# EAGLE design P1R3 (EAGLE 7.2.0)

## Sheet 1 of 2
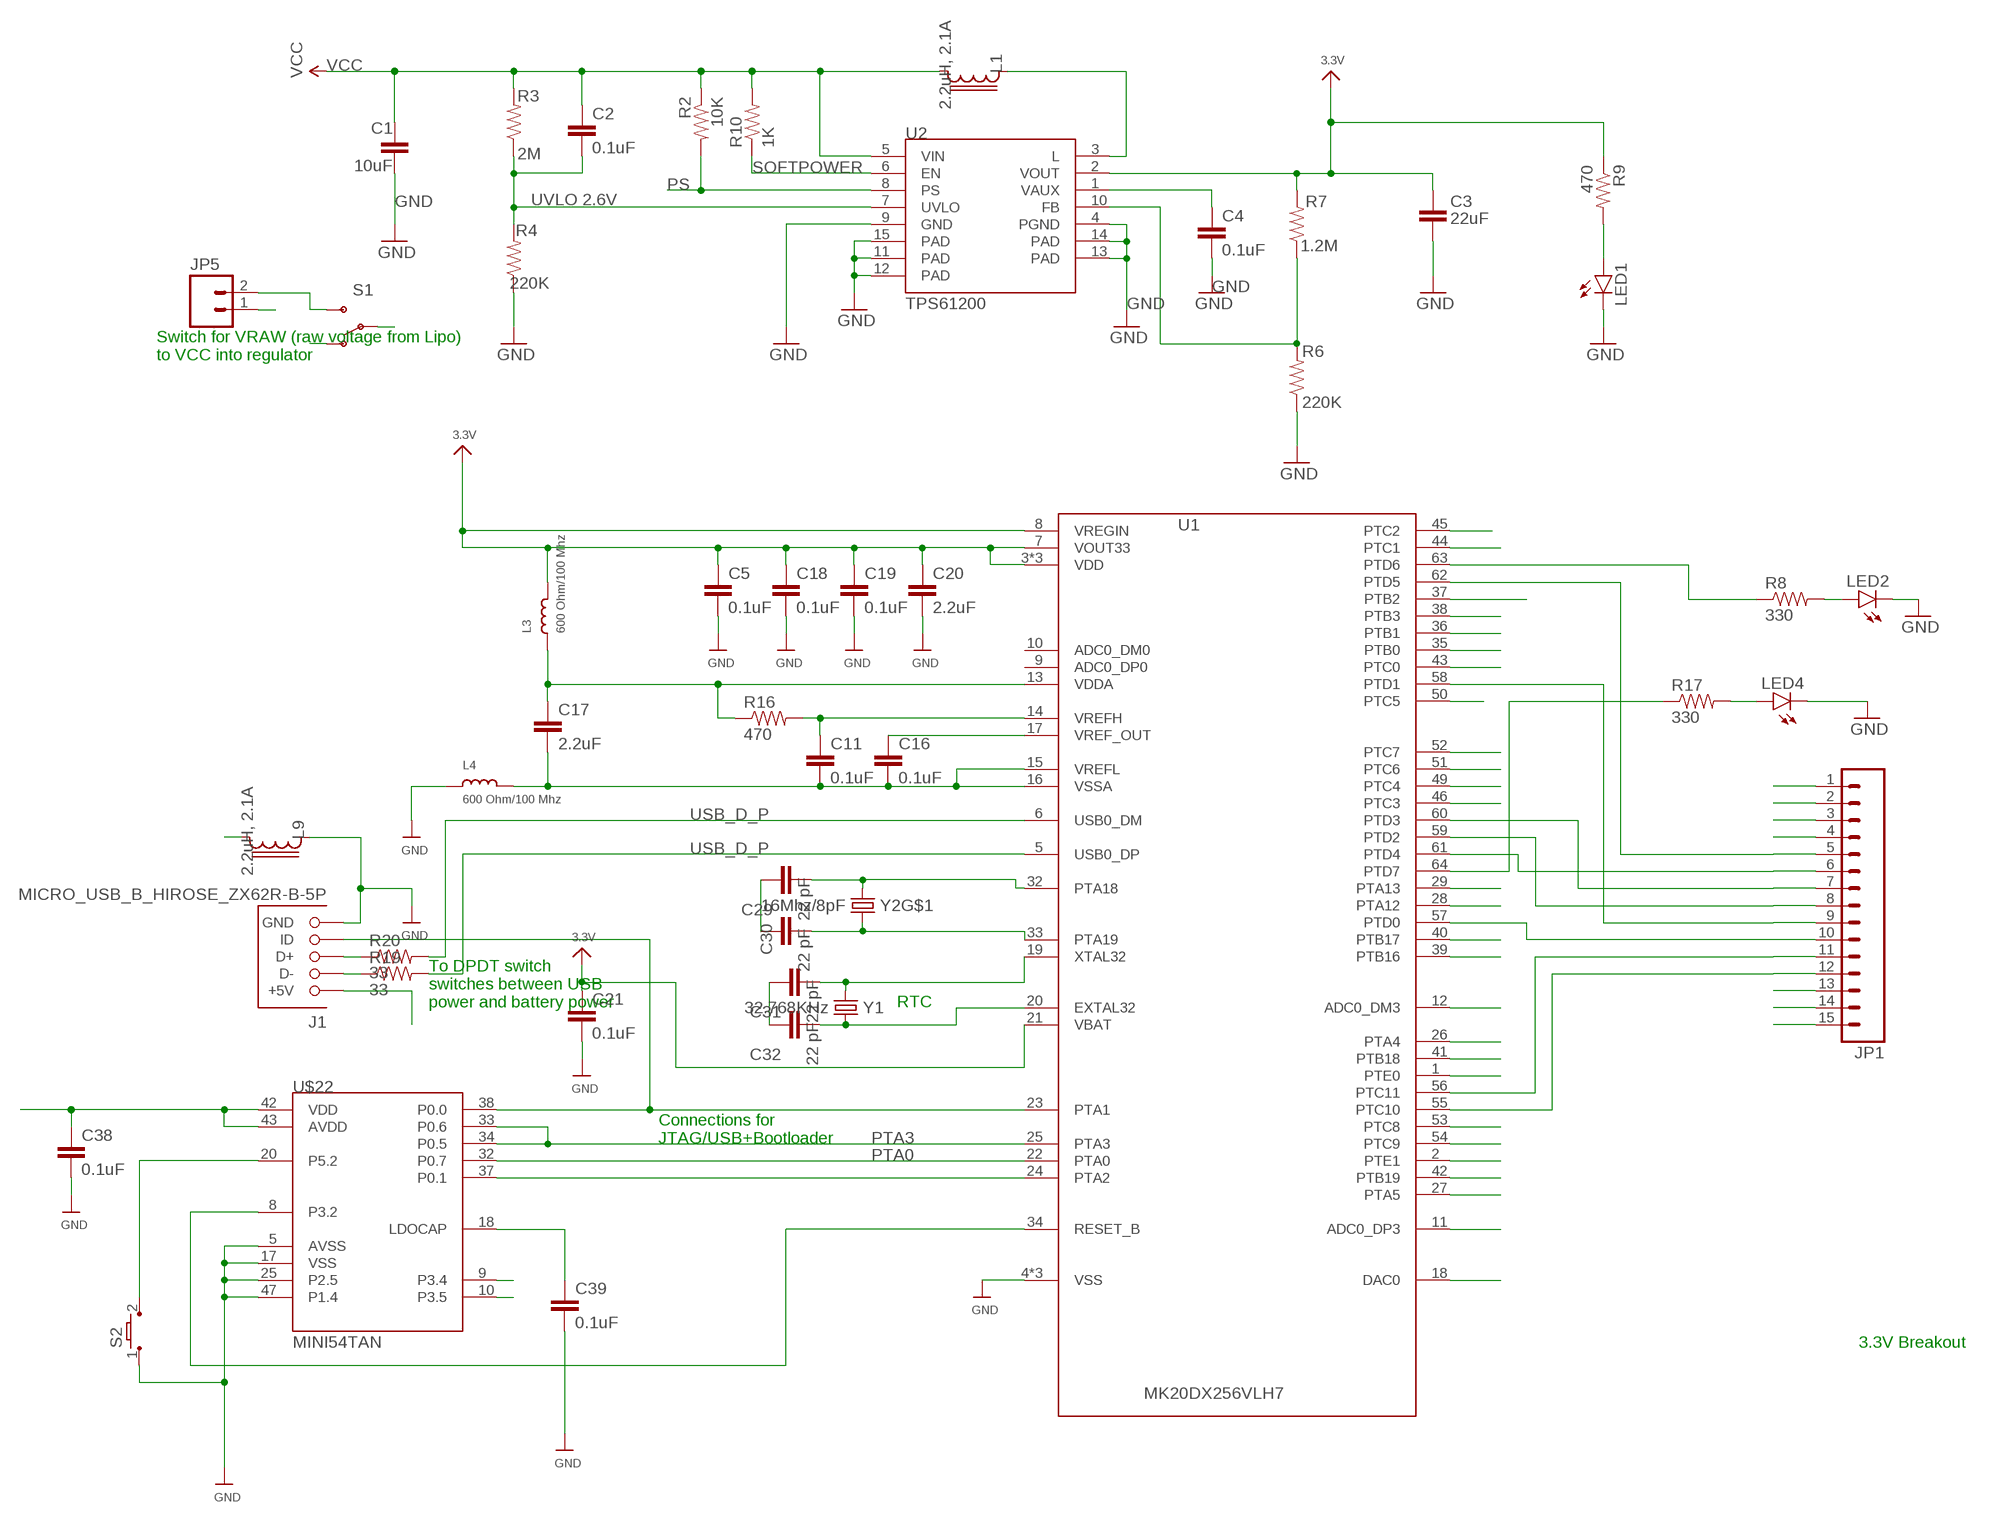
[diagram p0: schematic, sheet 1]

### Parts
C1  10uF  CAPACITOR-10UF  [0603-CAP]
C2  0.1uF  CAPACITOR-0.1UF  [0603-CAP]
C3  22uF  CAPACITOR-22UF  [0603-CAP]
C4  0.1uF  CAPACITOR-0.1UF  [0603-CAP]
C5  0.1uF  CAPACITOR-0.1UF  [0603-CAP]
C11  0.1uF  CAPACITOR-0.1UF  [0603-CAP]
C16  0.1uF  CAPACITOR-0.1UF  [0603-CAP]
C17  2.2uF  CAPACITOR-2.2UF  [0603-CAP]
C18  0.1uF  CAPACITOR-0.1UF  [0603-CAP]
C19  0.1uF  CAPACITOR-0.1UF  [0603-CAP]
C20  2.2uF  CAPACITOR-2.2UF  [0603-CAP]
C21  0.1uF  CAPACITOR-0.1UF  [0603-CAP]
C29  22 pF  CAPACITOR-10UF  [0603-CAP]
C30  22 pF  CAPACITOR-10UF  [0603-CAP]
C31  22 pF  CAPACITOR-10UF  [0603-CAP]
C32  22 pF  CAPACITOR-10UF  [0603-CAP]
C38  0.1uF  CAPACITOR-0.1UF  [0603-CAP]
C39  0.1uF  CAPACITOR-0.1UF  [0603-CAP]
J1  MICRO_USB_B_HIROSE_ZX62R-B-5P  [USB_MICRO_B-HIROSE-ZX62R-B-5P]
JP1  M15  [1X15]
JP5  M02PTH  [1X02]
L1  2.2uH, 2.1A  LPS30152.2UH  [LPS3015]
L3  600 Ohm/100 Mhz  INDUCTOR-BK2125HM601-T  [0805]
L4  600 Ohm/100 Mhz  INDUCTOR-BK2125HM601-T  [0805]
L9  2.2uH, 2.1A  LPS30152.2UH  [LPS3015]
LED1  LED-GREEN  [LED-0603]
LED2  LED-GREEN  [LED-0603]
LED4  LED-GREEN  [LED-0603]
R2  10K  RESISTOR-10K  [0603-RES]
R3  2M  RESISTOR-2M  [0603-RES]
R4  220K  RESISTOR-220K  [0603-RES]
R6  220K  RESISTOR-220K  [0603-RES]
R7  1.2M  RESISTOR-1.2M  [0603-RES]
R8  330  RESISTOR-470  [0603-RES]
R9  470  RESISTOR-470  [0603-RES]
R10  1K  RESISTOR-1K  [0603-RES]
R16  470  RESISTOR-470  [0603-RES]
R17  330  RESISTOR-470  [0603-RES]
R19  33  RESISTOR0402-RES  [0402-RES]
R20  33  RESISTOR0402-RES  [0402-RES]
S1  SWITCH-SPDT-SMD-A  [SWITCH-SPST-SMD-A]
S2  TL3302-G  [TL3302_GULL_WING]
U1  MK20DX256VLH7  [MK20DX256VLH7]
U2  TPS61200  [QFN-10_PAD]
U$22  MINI54TAN  [MINI54TAN]
Y1  32.768KHz  CRYSTAL/32.768KHZ/SMD-TXC_7A  [CRYSTAL-TXC-7A]
Y2  16Mhz/8pF  CRYSTAL/SMD-5X3-GND16MHZ/8PF  [CRYSTAL-SMD-5X3]

### Nets
3.3V: C3.1 C5.1 C18.1 C19.1 C20.1 C21.1 C38.1 JP1.13 JP1.14 JP1.15 L3.2 R7.2 R9.1 U1.3(VDD) U1.7(VOUT33) U1.8(VREGIN) U1.21(VBAT) U1.30(VDD) U1.48(VDD) U2.2(VOUT) U$22.42(VDD) U$22.43(AVDD) ; also sheet 2
A12: U1.11(ADC0_DP3)
A13: U1.12(ADC0_DM3)
AD0: U1.45(PTC2) ; also sheet 2
DAC/A14: U1.18(DAC0)
FB: R6.2 R7.1 U2.10(FB)
GND [Top GND Pour]: C1.2 C3.2 C4.2 C5.2 C18.2 C19.2 C20.2 C21.2 C29.1 C30.1 C31.1 C32.1 C38.2 C39.2 J1.5(GND) JP1.1 JP1.2 JP1.3 JP1.4 JP5.1 L4.1 L9.1 LED1.C LED2.C LED4.C R4.1 R6.1 S2.1 U1.4(VSS) U1.31(VSS) U1.47(VSS) U2.4(PGND) U2.9(GND) U2.11(PAD) U2.12(PAD) U2.13(PAD) U2.14(PAD) U2.15(PAD) U$22.5(AVSS) U$22.17(VSS) U$22.25(P2.5) U$22.47(P1.4) ; also sheet 2
ID: J1.4(ID) U1.23(PTA1) U$22.38(P0.0)
N$1: LED1.A R9.2
N$2: L1.1 U2.3(L)
N$7: LED2.A R8.2
N$8: J1.3(D+) R20.1
N$9: J1.2(D-) R19.1
N$10: C31.2 U1.19(XTAL32) Y1.P$2
N$11: C32.2 U1.20(EXTAL32) Y1.P$1
N$27: C29.2 U1.32(PTA18) Y2.3
N$28: C30.2 U1.33(PTA19) Y2.1
N$29: LED4.A R17.2
N$40: L9.2
N$49: C39.1 U$22.18(LDOCAP)
N$50: U$22.9(P3.4)
N$51: U$22.10(P3.5)
N$75: S2.2 U$22.20(P5.2)
PS: R2.2 U2.8(PS)
PTA0: U1.22(PTA0) U$22.32(P0.7)
PTA2: U1.24(PTA2) U$22.37(P0.1)
PTA3: U1.25(PTA3) U$22.33(P0.6) U$22.34(P0.5)
PTA4: U1.26(PTA4)
PTA5: U1.27(PTA5)
PTA12: U1.28(PTA12)
PTA13: U1.29(PTA13)
PTB0: U1.35(PTB0) ; also sheet 2
PTB1: U1.36(PTB1) ; also sheet 2
PTB16: U1.39(PTB16) ; also sheet 2
PTB17: U1.40(PTB17) ; also sheet 2
PTB18: U1.41(PTB18) ; also sheet 2
PTB19: U1.42(PTB19) ; also sheet 2
PTC0: U1.43(PTC0) ; also sheet 2
PTC1: U1.44(PTC1) ; also sheet 2
PTC3: U1.46(PTC3) ; also sheet 2
PTC4: U1.49(PTC4) ; also sheet 2
PTC5: U1.50(PTC5) ; also sheet 2
PTC6: U1.51(PTC6) ; also sheet 2
PTC7: U1.52(PTC7) ; also sheet 2
PTC8: U1.53(PTC8) ; also sheet 2
PTC9: U1.54(PTC9) ; also sheet 2
PTC10: JP1.12 U1.55(PTC10)
PTC11: JP1.11 U1.56(PTC11)
PTD0: JP1.10 U1.57(PTD0)
PTD1: JP1.9 U1.58(PTD1)
PTD2: JP1.8 U1.59(PTD2)
PTD3: JP1.7 U1.60(PTD3)
PTD4: JP1.6 U1.61(PTD4)
PTD5: JP1.5 U1.62(PTD5)
PTD6: R8.1 U1.63(PTD6)
PTD7: R17.1 U1.64(PTD7)
PTE0: U1.1(PTE0)
PTE1: U1.2(PTE1)
RESET_B: U1.34(RESET_B) U$22.8(P3.2)
SCL: U1.37(PTB2) ; also sheet 2
SDA: U1.38(PTB3) ; also sheet 2
SOFTPOWER: R10.1 U2.6(EN)
USB_D_N [USB]: R19.2 U1.5(USB0_DP)
USB_D_P [USB]: R20.2 U1.6(USB0_DM)
UVLO: C2.2 R3.1 R4.2 U2.7(UVLO)
VAUX: C4.1 U2.1(VAUX)
VBAT: JP5.2 S1.3(S)
VCC: C1.1 C2.1 L1.2 R2.1 R3.2 R10.2 S1.2(P) U2.5(VIN)
VDDA: C17.1 L3.1 R16.1 U1.13(VDDA)
VREF_OUT: C16.1 U1.17(VREF_OUT)
VREFH: C11.1 R16.2 U1.14(VREFH)
VREFL: C11.2 C16.2 C17.2 L4.2 U1.15(VREFL) U1.16(VSSA)
VUSB: J1.1(+5V) S1.1(O)
Unconnected: U1.9(ADC0_DP0) U1.10(ADC0_DM0) Y2.2(GND:GND) Y2.4(GND:GND)

### Notes on the sheet
- UVLO 2.6V
- Switch for VRAW (raw voltage from Lipo) 
  to VCC into regulator
- To DPDT switch
  switches between USB
  power and battery power
- RTC
- Connections for 
  JTAG/USB+Bootloader
- 3.3V Breakout

## Sheet 2 of 2
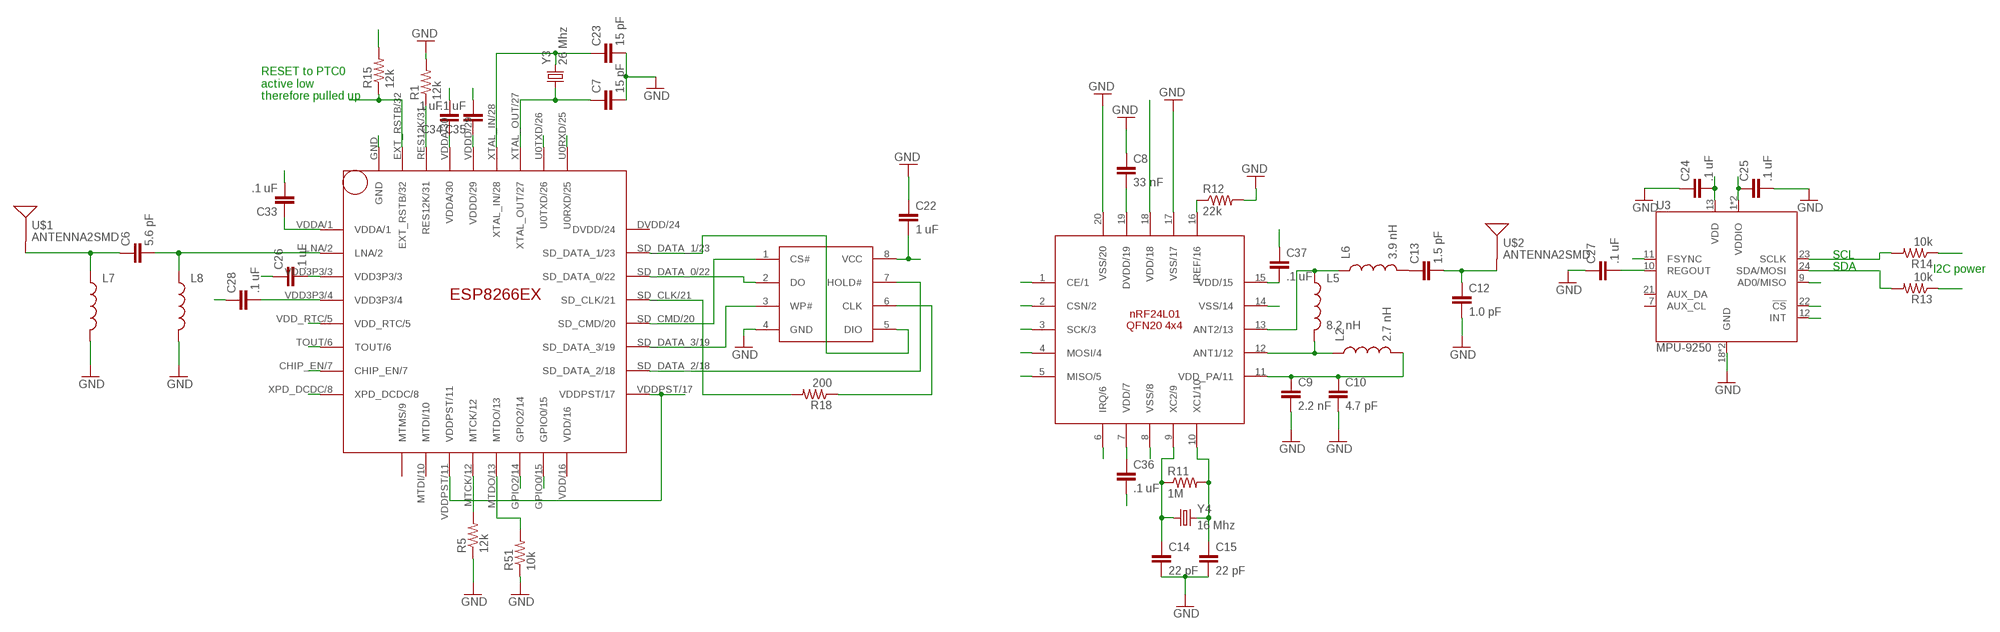
[diagram p1: schematic, sheet 2]

### Parts
C6  5.6 pF  CAP0603-CAP  [0603-CAP]
C7  15 pF  CAP0603-CAP  [0603-CAP]
C8  33 nF  CAP0603-CAP  [0603-CAP]
C9  2.2 nF  CAP0603-CAP  [0603-CAP]
C10  4.7 pF  CAP0603-CAP  [0603-CAP]
C12  1.0 pF  CAP0603-CAP  [0603-CAP]
C13  1.5 pF  CAP0603-CAP  [0603-CAP]
C14  22 pF  CAP0603-CAP  [0603-CAP]
C15  22 pF  CAP0603-CAP  [0603-CAP]
C22  1 uF  CAP0603-CAP  [0603-CAP]
C23  15 pF  CAP0603-CAP  [0603-CAP]
C24  .1 uF  CAP0603-CAP  [0603-CAP]
C25  .1 uF  CAP0603-CAP  [0603-CAP]
C26  .1 uF  CAP0603-CAP  [0603-CAP]
C27  .1 uF  CAP0603-CAP  [0603-CAP]
C28  .1 uF  CAP0603-CAP  [0603-CAP]
C33  .1 uF  CAP0603-CAP  [0603-CAP]
C34  .1 uF  CAP0603-CAP  [0603-CAP]
C35  .1 uF  CAP0603-CAP  [0603-CAP]
C36  .1 uF  CAP0603-CAP  [0603-CAP]
C37  .1 uF  CAP0603-CAP  [0603-CAP]
L2  2.7 nH  INDUCTOR0402  [C0402]
L5  8.2 nH  INDUCTOR0402  [C0402]
L6  3.9 nH  INDUCTOR0402  [C0402]
L7  INDUCTOR30OHM,1.8A  [0603]
L8  INDUCTOR30OHM,1.8A  [0603]
R1  12k  RESISTOR0603-RES  [0603-RES]
R5  12k  RESISTOR0603-RES  [0603-RES]
R11  1M  RESISTOR0603-RES  [0603-RES]
R12  22k  RESISTOR0603-RES  [0603-RES]
R13  10k  RESISTOR0603-RES  [0603-RES]
R14  10k  RESISTOR0603-RES  [0603-RES]
R15  12k  RESISTOR0603-RES  [0603-RES]
R18  200  RESISTOR0603-RES  [0603-RES]
R51  10k  RESISTOR0603-RES  [0603-RES]
U3  MPU-9250  [QFN-24/3MM]
U$1  ANTENNA2SMD  [ANTENNA-CHIP2]
U$2  ANTENNA2SMD  [ANTENNA-CHIP2]
U$3  25Q40  [SOP8]
U$4  NRF24L01  [QFN20(4X4)]
U$6  ESP8266EX  [QFN32]
Y3  26 Mhz  CRYSTAL5X3  [CRYSTAL-SMD-5X3]
Y4  16 Mhz  CRYSTAL5X3  [CRYSTAL-SMD-5X3]

### Nets
3.3V: C22.2 C24.2 C25.1 C26.2 C28.2 C33.1 C34.1 C35.1 C36.1 C37.2 R13.1 R14.1 R15.2 U3.1(VDDIO) U3.8(VDDIO) U3.13(VDD) U3.22(!CS) U$3.8(VCC) U$4.7(VDD/7) U$4.15(VDD/15) U$4.18(VDD/18) U$6.VDD3P3/3 U$6.VDD3P3/4 U$6.VDDA/1 U$6.VDDA/30 U$6.VDDD/29 U$6.VDDPST/11 U$6.VDDPST/17 ; also sheet 1
AD0: U3.9(AD0/MISO) ; also sheet 1
GND [Top GND Pour]: C7.2 C8.1 C9.2 C10.2 C12.2 C14.2 C15.2 C22.1 C23.2 C24.1 C25.2 C26.1 C27.1 C28.1 C33.2 C34.2 C35.2 C36.2 C37.1 L7.2 L8.2 R1.2 R5.1 R12.2 R51.1 U3.18(GND) U3.20(GND) U$3.4(GND) U$4.8(VSS/8) U$4.14(VSS/14) U$4.17(VSS/17) U$4.20(VSS/20) U$6.GND ; also sheet 1
MTDO: R51.2 U$6.MTDO/13
N$13: C6.2 L8.1 U$6.LNA/2
N$16: C6.1 L7.1 U$1.FEED(SIGNAL)
N$17: C14.1 R11.1 U$4.9(XC2/9) Y4.1
N$18: C15.1 R11.2 U$4.10(XC1/10) Y4.3
N$19: C9.1 C10.1 L2.2 U$4.11(VDD_PA/11)
N$20: L5.1 L6.1 U$4.13(ANT2/13)
N$21: C8.2 U$4.19(DVDD/19)
N$23: L2.1 L5.2 U$4.12(ANT1/12)
N$24: R12.1 U$4.16(IREF/16)
N$25: C13.1 L6.2
N$26: C12.1 C13.2 U$2.FEED(SIGNAL)
N$32: R5.2 U$6.MTCK/12
N$34: C27.2 U3.10(REGOUT)
N$35: R18.1 U$3.6(CLK)
N$38: R1.1 U$6.RES12K/31
PTB0: U3.12(INT) ; also sheet 1
PTB1: U3.11(FSYNC) ; also sheet 1
PTB16: U$6.U0TXD/26 ; also sheet 1
PTB17: U$6.U0RXD/25 ; also sheet 1
PTB18: U$6.GPIO0/15 ; also sheet 1
PTB19: U$6.GPIO2/14 ; also sheet 1
PTC0: R15.1 U$6.EXT_RSTB/32 ; also sheet 1
PTC1: U$6.CHIP_EN/7 ; also sheet 1
PTC3: U$6.XPD_DCDC/8 ; also sheet 1
PTC4: U$4.2(CSN/2) ; also sheet 1
PTC5: U$4.3(SCK/3) ; also sheet 1
PTC6: U$4.4(MOSI/4) ; also sheet 1
PTC7: U$4.5(MISO/5) ; also sheet 1
PTC8: U$4.6(IRQ/6) ; also sheet 1
PTC9: U$4.1(CE/1) ; also sheet 1
RTC: U$6.VDD_RTC/5
SCL: R14.2 U3.23(SCLK) ; also sheet 1
SD-CLK: R18.2 U$6.SD_CLK/21
SD-CMD: U$3.1(CS#) U$6.SD_CMD/20
SD-D0: U$3.2(DO) U$6.SD_DATA_0/22
SD-D1: U$3.5(DIO) U$6.SD_DATA_1/23
SD-D2: U$3.7(HOLD#) U$6.SD_DATA_2/18
SD-D3: U$3.3(WP#) U$6.SD_DATA_3/19
SDA: R13.2 U3.24(SDA/MOSI) ; also sheet 1
TOUT: U$6.TOUT/6
XTAL_IN: C23.1 U$6.XTAL_IN/28 Y3.3
XTAL_OUT: C7.1 U$6.XTAL_OUT/27 Y3.1
Unconnected: U3.7(AUX_CL) U3.21(AUX_DA) U$6.DVDD/24 U$6.MTDI/10 U$6.MTMS/9 U$6.VDD/16

### Notes on the sheet
- RESET to PTC0
  active low
  therefore pulled up
- SCL
- I2C power
- SDA

## Library data of the parts
C1 = appfruits:CAPACITOR; MF: Murata; MPN: GRM188R60J106ME47D
C2 C4 C5 C11 C16 C18 C19 C21 C38 C39 = appfruits:CAPACITOR; MF: Kemet; MPN: C0603C104J3RACTU
C3 = appfruits:CAPACITOR; MF: Murata; MPN: GRM188R60J226MEA0D
C6-C10 C12-C15 C22-C28 C33-C37 = SparkFun-Capacitors:CAP: Capacitor Standard 0603 ceramic capacitor, and 0.1" leaded capacitor.
C17 C20 = appfruits:CAPACITOR; MF: Kemet; MPN: C0603C225K4PACTU
C29-C32 = appfruits:CAPACITOR; MF: Murata; MPN: GRM188R60J106ME47D; VALUE: 10uF
J1 = connector:MICRO_USB_B_HIROSE_ZX62R-B-5P: USB Micro B Connector Rounded side is up.; DIGIKEY: H11574CT-ND; MOUSER: 798-ZX62R-B-5P; NEWARK: 69W0714
JP1 = SparkFun-Connectors:M15: Header 15 Standard 15-pin 0.1" header. Use with straight break away headers (SKU : PRT-00116), right angle break away headers (PRT-00553), swiss pins (PRT-00743), machine pins (PRT-00117), and female headers (PRT-00115).
JP5 = SparkFun-Connectors:M02: Standard 2-pin 0.1" header. Use with - straight break away headers ( PRT-00116) - right angle break away headers (PRT-00553) - swiss pins (PRT-00743) - machine pins (PRT-00117) - female headers (PRT-00115) Molex polarized connector foot print use with: PRT-08233 with associated crimp pins and housings. 2.54_SCREWTERM for use with PRT-10571. 3.5mm Screw Terminal footprints for PRT-08084 5mm Screw Terminal footprints for use with PRT-08432
L1 L9 = appfruits:LPS3015: Shielded Power Inductor; MF: Coilcraft; MPN: LPS3015-222MRB
L2 L5 L6 = SparkFun-Passives:INDUCTOR: Inductors
L3 L4 = appfruits:INDUCTOR: Inductors; MF: Taiyo Yuden; MPN: BK2125HM601-T
L7 L8 = SparkFun-Passives:INDUCTOR: Inductors; PROD_ID: RES-07859
LED1 LED2 LED4 = appfruits:LED: LEDs Standard schematic elements and footprints for 5mm, 3mm, 1206, and 0603 sized LEDs. 5mm - Spark Fun Electronics SKU : COM-00529 (and others); MF: Avago; MPN: HSMG-C190
R1 R5 R11-R15 R18 R51 = SparkFun-Resistors:RESISTOR: Resistor
R2 = appfruits:RESISTOR: Resistor; MF: Panasonic; MPN: ERJ-3GEYJ103V
R3 = appfruits:RESISTOR: Resistor; MF: Panasonic; MPN: ERJ-3GEYJ205V
R4 R6 = appfruits:RESISTOR: Resistor; MF: Panasonic; MPN: ERJ-3GEYJ224V
R7 = appfruits:RESISTOR: Resistor; MF: Panasonic; MPN: ERJ-3GEYJ125V
R8 R17 = appfruits:RESISTOR: Resistor; MF: Panasonic; MPN: ERJ-3GEYJ471V; VALUE: 470
R9 R16 = appfruits:RESISTOR: Resistor; MF: Panasonic; MPN: ERJ-3GEYJ471V
R10 = appfruits:RESISTOR: Resistor; MF: Panasonic; MPN: ERJ-3GEYJ102V
R19 R20 = SparkFun:RESISTOR: Resistor
S1 = SparkFun-Electromechanical:SWITCH-SPDT: SPDT Switch Simple slide switch, Spark Fun Electronics SKU : COM-00102 DPDT SMT slide switch, AYZ0202, SWCH-08179
S2 = eswitch-tact:TL3302: E-Switch TL3302 Series Tactile Switch Surface mount button commonly used for reset or general input. 3.5 x 6mm packaged design. -G: Gull wing termination. Parts TL-3302-x-xxxx-x-G -J: J-Lead termination. Parts TL-3302-x-xxxx-x-J Source: http://www.e-switch.com/Portals/0/Series_Pdf/TL3302.pdf Supplier: DigiKey: http://be.digikey.com/scripts/dksearch/dksus.dll?vendor=0&keywords=TL3302
U1 = appfruits:MK20DX256VLH7; MF: Freescale; MPN: MK20DX256VLH7
U2 = appfruits:TPS61200: DC to DC Booster IC-10035; MF: Texas Instruments; MPN: TPS61200DRCR; PROD_ID: IC-10035
U3 = chips:MPU-9250: GYRO/ACCEL/COMPASS/9-AXIS; DIGIKEY: 1428-1019-1-ND
U$1 U$2 = SparkFun-RF:ANTENNA2: Chip antenna Single endded antenna. Common with smaller chip antennas. CHIP4 package is the GPS Chip Antenna SKU: GPS-08418. CHIP5 package is 2.4GHz chip antenna SKU: WRL-00144.
U$3 = wifi:25Q40
U$4 = RF:NRF24L01
U$6 = wifi:ESP8266EX
U$22 = TeensyCustom:MINI54TAN: MINI54TAN Bootloader from PJRC.com, preprogrammed with Teensy 3.0 bootloader. https://www.pjrc.com/store/ic_mini54_tqfp.html
Y1 = appfruits:CRYSTAL/32.768KHZ/SMD-TXC_7A; MF: Epson Timing; MPN: FC-255 32.7680K-A3
Y2 = appfruits:CRYSTAL/SMD-5X3-GND; MF: ECS; MPN: ECS-160-8-30B-CKM
Y3 Y4 = SparkFun-FreqCtrl:CRYSTAL: Various standard crystals. Proven footprints.; PROD_ID: XTAL-08218

## Net classes
1 USB: width 0.254 mm, drill 0.33 mm, clearance 0.159 mm
2 Top GND Pour: clearance 0.127 mm to class 0, clearance 1.27 mm to class 1

## Board
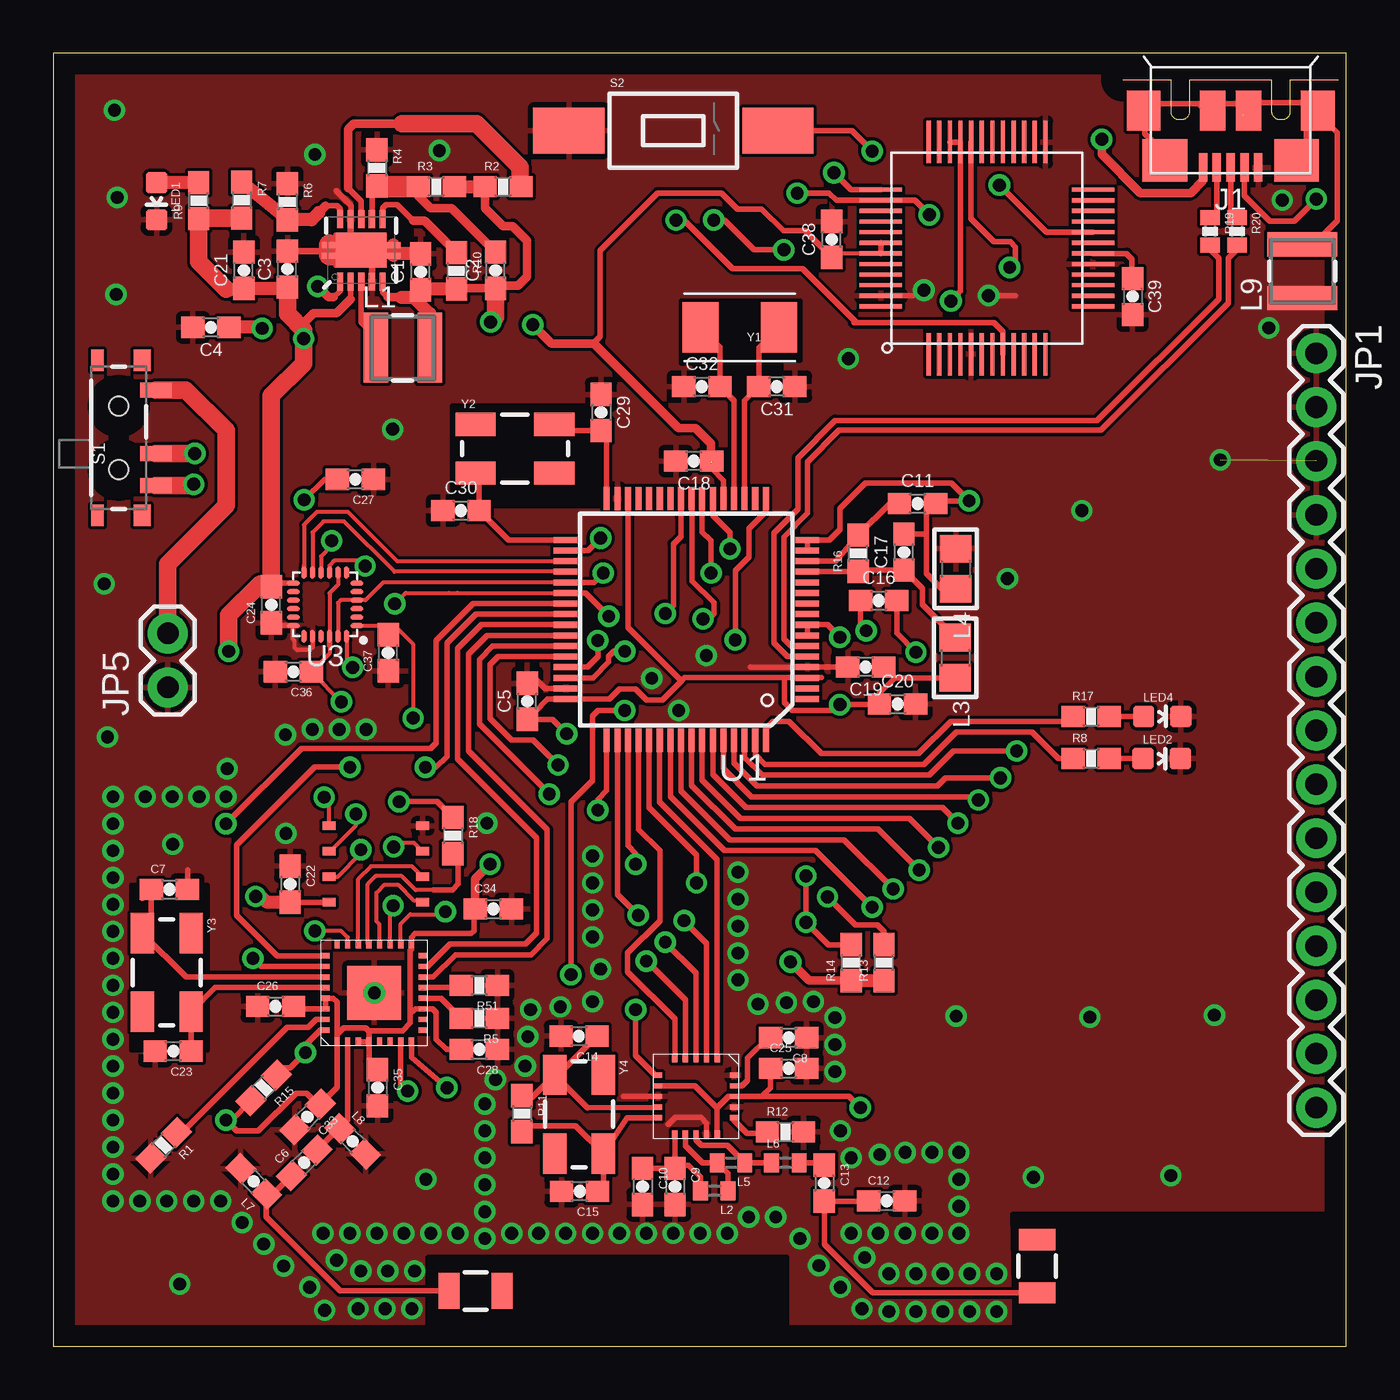
[diagram p2: board, top side]
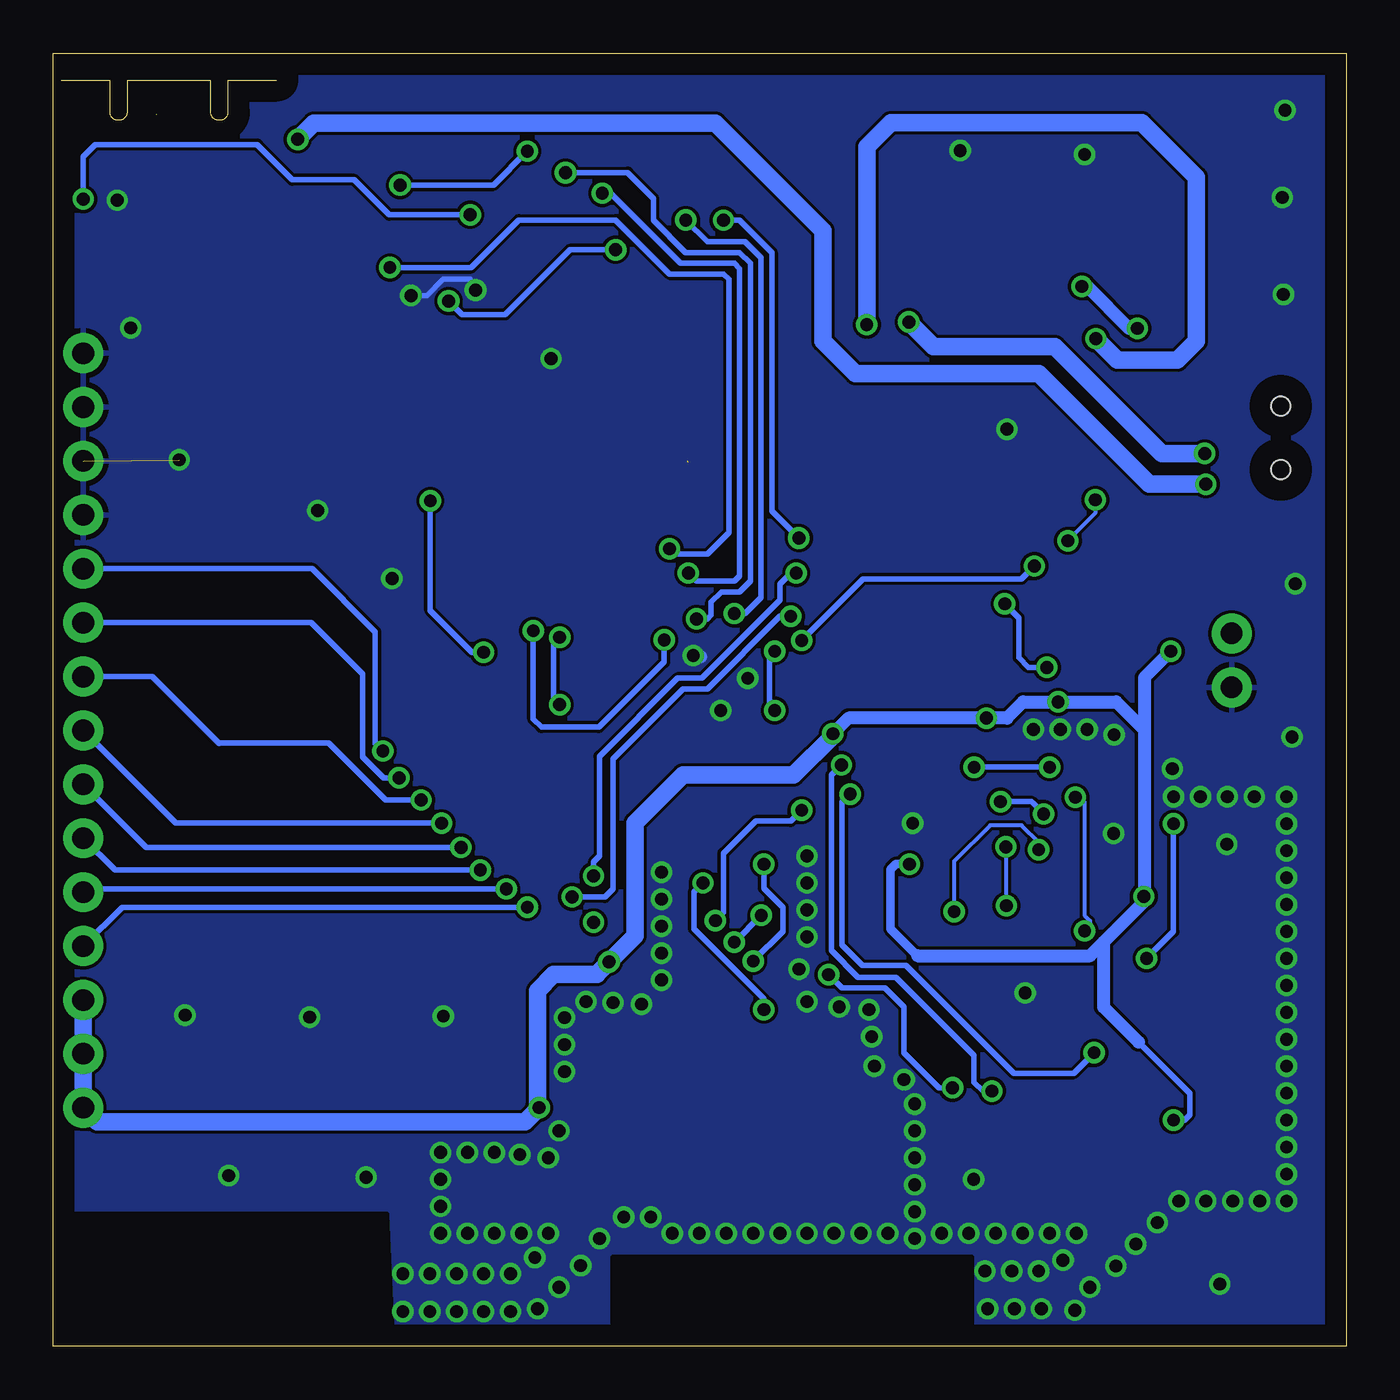
[diagram p3: board, bottom side, seen from below]

Size 60.96 x 60.96 mm. Coordinates in mm from the lower left corner, seen from the top.
Outline: 0,0 60.96,0 60.96,60.96 0,60.96 0,0
Copper layers (1*16): Top 0.035mm / dielectric 1.5mm / Bottom 0.035mm
Design rules "default *": minimum track width 10mil, minimum drill 23mil, track to track 6mil, track to pad 6mil, pad to pad 6mil, via to via 6mil, smd to smd 8mil, copper to edge 40mil, drill to drill 8mil, minimum pad ring 10mil, minimum via ring 8mil, stop-mask expansion 4mil, vias tented up to drill 0mil, thermal gap 10mil
tRestrict: area 3.7,14 to 7.3,21.7; area 18.8,39.6 to 25.8,44.3; area 29.6,44.8 to 35.2,49.3; area 45.2,0.5 to 60.6,6.2; area 17.7,0.3 to 34.6,4.2; area 11.9,50.6 to 16.9,52.8; area 53.5,56.2 to 57.5,57.4
bRestrict: area 45,0.5 to 60.6,6.2; area 17.7,0.3 to 34.6,4.2

### Footprints (pad centres in the part's own frame; a part is rotated, then mirrored left to right if it is on the bottom)
0603-CAP = smd 1.1 x 1: 1 -0.85,0; 2 0.85,0
USB_MICRO_B-HIROSE-ZX62R-B-5P = smd 0.4 x 1.35: 1 1.3,4.125; 2 0.65,4.125; 3 0,4.125; 4 -0.65,4.125; 5 -1.3,4.125 | smd 2.1 x 2: P$1 3.1,3.8; P$2 -3.1,3.8 | smd 1.6 x 1.9: P$3 -4.1,1.45; P$6 4.1,1.45 | smd 1.2 x 1.9: P$4 -0.85,1.45; P$5 0.85,1.45
1X15 = drill 1.016 pad 1.88: 1 0,0; 2 2.54,0; 3 5.08,0; 4 7.62,0; 5 10.16,0; 6 12.7,0; 7 15.24,0; 8 17.78,0; 9 20.32,0; 10 22.86,0; 11 25.4,0; 12 27.94,0; 13 30.48,0; 14 33.02,0; 15 35.56,0
1X02 = drill 1.016 pad 1.88: 1 0,0; 2 2.54,0
LPS3015 = smd 1.14 x 3.3: 1 -1.27,0; 2 1.27,0
C0402 = smd 0.7 x 0.9: 1 -0.65,0; 2 0.65,0
0805 = smd 1.3 x 1.5: 1 -0.95,0; 2 0.95,0
0603 = smd 1.1 x 1: 1 -0.85,0; 2 0.85,0
LED-0603 = smd 1 x 1: A 0,-0.877; C 0,0.877
0603-RES = smd 1.1 x 1: 1 -0.85,0; 2 0.85,0
0402-RES = smd 0.7 x 0.9: 1 -0.65,0; 2 0.65,0
SWITCH-SPST-SMD-A = smd 0.7 x 1.5: 1 -2.25,-1.75; 2 -0.75,-1.75; 3 2.25,-1.75 | smd 1 x 0.6: GND1 -3.65,1; GND3 3.65,1 | smd 1 x 0.8: GND2 -3.65,-1.1; GND4 3.65,-1.1 | hole 0.9: -1.5,0; 1.5,0
TL3302_GULL_WING = smd 3.35 x 2.16: 1 -4.925,0; 2 4.925,0
MK20DX256VLH7 = smd 1.1 x 0.285: 1 -5.7,3.75; 2 -5.7,3.25; 3 -5.7,2.75; 4 -5.7,2.25; 5 -5.7,1.75; 6 -5.7,1.25; 7 -5.7,0.75; 8 -5.7,0.25; 9 -5.7,-0.25; 10 -5.7,-0.75; 11 -5.7,-1.25; 12 -5.7,-1.75; 13 -5.7,-2.25; 14 -5.7,-2.75; 15 -5.7,-3.25; 16 -5.7,-3.75; 33 5.7,-3.75; 34 5.7,-3.25; 35 5.7,-2.75; 36 5.7,-2.25; 37 5.7,-1.75; 38 5.7,-1.25; 39 5.7,-0.75; 40 5.7,-0.25; 41 5.7,0.25; 42 5.7,0.75; 43 5.7,1.25; 44 5.7,1.75; 45 5.7,2.25; 46 5.7,2.75; 47 5.7,3.25; 48 5.7,3.75 | smd 0.285 x 1.1: 17 -3.75,-5.7; 18 -3.25,-5.7; 19 -2.75,-5.7; 20 -2.25,-5.7; 21 -1.75,-5.7; 22 -1.25,-5.7; 23 -0.75,-5.7; 24 -0.25,-5.7; 25 0.25,-5.7; 26 0.75,-5.7; 27 1.25,-5.7; 28 1.75,-5.7; 29 2.25,-5.7; 30 2.75,-5.7; 31 3.25,-5.7; 32 3.75,-5.7; 49 3.75,5.7; 50 3.25,5.7; 51 2.75,5.7; 52 2.25,5.7; 53 1.75,5.7; 54 1.25,5.7; 55 0.75,5.7; 56 0.25,5.7; 57 -0.25,5.7; 58 -0.75,5.7; 59 -1.25,5.7; 60 -1.75,5.7; 61 -2.25,5.7; 62 -2.75,5.7; 63 -3.25,5.7; 64 -3.75,5.7
QFN-10_PAD = smd 0.297 x 0.85: 1 -1,-1.475; 2 -0.5,-1.475; 3 0,-1.475; 4 0.5,-1.475; 5 1,-1.475; 6 1,1.475; 7 0.5,1.475; 8 0,1.475; 9 -0.5,1.475; 10 -1,1.475 | smd 0.7 x 0.28: 11 -1.5,0.25; 12 -1.5,-0.25; 13 1.5,0.25; 14 1.5,-0.25 | smd 2.4 x 1.65: 15 0,0
QFN-24/3MM = smd 0.6 x 0.23: 1 -1.5,1; 2 -1.5,0.6; 3 -1.5,0.2; 4 -1.5,-0.2; 5 -1.5,-0.6; 6 -1.5,-1; 13 1.5,-1; 14 1.5,-0.6; 15 1.5,-0.2; 16 1.5,0.2; 17 1.5,0.6; 18 1.5,1 | smd 0.23 x 0.6: 7 -1,-1.5; 8 -0.6,-1.5; 9 -0.2,-1.5; 10 0.2,-1.5; 11 0.6,-1.5; 12 1,-1.5; 19 1,1.5; 20 0.6,1.5; 21 0.2,1.5; 22 -0.2,1.5; 23 -0.6,1.5; 24 -1,1.5
ANTENNA-CHIP2 = smd 1.7 x 1: FEED 0,1.25; P$2 0,-1.25
SOP8 = smd 0.6 x 0.4: 1 -2.2,1.8; 2 -2.2,0.6; 3 -2.2,-0.6; 4 -2.2,-1.8; 5 2.2,-1.8; 6 2.2,-0.6; 7 2.2,0.6; 8 2.2,1.8
QFN20(4X4) = smd 0.4 x 0.25: 1 -1.8,1; 2 -1.8,0.5; 3 -1.8,0; 4 -1.8,-0.5; 5 -1.8,-1; 11 1.8,-1; 12 1.8,-0.5; 13 1.8,0; 14 1.8,0.5; 15 1.8,1 | smd 0.25 x 0.4: 6 -1,-1.8; 7 -0.5,-1.8; 8 0,-1.8; 9 0.5,-1.8; 10 1,-1.8; 16 1,1.8; 17 0.5,1.8; 18 0,1.8; 19 -0.5,1.8; 20 -1,1.8
QFN32 = smd 0.4 x 0.25: CHIP_EN/7 -2.3,-1.25; DVDD/24 2.3,1.75; LNA/2 -2.3,1.25; SD_CLK/21 2.3,0.25; SD_CMD/20 2.3,-0.25; SD_DATA_0/22 2.3,0.75; SD_DATA_1/23 2.3,1.25; SD_DATA_2/18 2.3,-1.25; SD_DATA_3/19 2.3,-0.75; TOUT/6 -2.3,-0.75; VDD3P3/3 -2.3,0.75; VDD3P3/4 -2.3,0.25; VDD_RTC/5 -2.3,-0.25; VDDA/1 -2.3,1.75; VDDPST/17 2.3,-1.75; XPD_DCDC/8 -2.3,-1.75 | smd 0.25 x 0.4: EXT_RSTB/32 -1.75,2.3; GPIO0/15 1.25,-2.3; GPIO2/14 0.75,-2.3; MTCK/12 -0.25,-2.3; MTDI/10 -1.25,-2.3; MTDO/13 0.25,-2.3; MTMS/9 -1.75,-2.3; RES12K/31 -1.25,2.3; U0RXD/25 1.75,2.3; U0TXD/26 1.25,2.3; VDD/16 1.75,-2.3; VDDA/30 -0.75,2.3; VDDD/29 -0.25,2.3; VDDPST/11 -0.75,-2.3; XTAL_IN/28 0.25,2.3; XTAL_OUT/27 0.75,2.3 | smd 2.54 x 2.54: GND 0,0
MINI54TAN = smd 0.2 x 2: 1 -2.75,-5; 2 -2.25,-5; 3 -1.75,-5; 4 -1.25,-5; 5 -0.75,-5; 6 -0.25,-5; 7 0.25,-5; 8 0.75,-5; 9 1.25,-5; 10 1.75,-5; 11 2.25,-5; 12 2.75,-5; 25 2.75,5; 26 2.25,5; 27 1.75,5; 28 1.25,5; 29 0.75,5; 30 0.25,5; 31 -0.25,5; 32 -0.75,5; 33 -1.25,5; 34 -1.75,5; 35 -2.25,5; 36 -2.75,5 | smd 2 x 0.2: 13 5,-2.75; 14 5,-2.25; 15 5,-1.75; 16 5,-1.25; 17 5,-0.75; 18 5,-0.25; 19 5,0.25; 20 5,0.75; 21 5,1.25; 22 5,1.75; 23 5,2.25; 24 5,2.75; 37 -5,2.75; 38 -5,2.25; 39 -5,1.75; 40 -5,1.25; 41 -5,0.75; 42 -5,0.25; 43 -5,-0.25; 44 -5,-0.75; 45 -5,-1.25; 46 -5,-1.75; 47 -5,-2.25; 48 -5,-2.75
CRYSTAL-TXC-7A = smd 1.7 x 2.4: P$1 1.85,0; P$2 -1.85,0
CRYSTAL-SMD-5X3 = smd 1.9 x 1.1: 1 -1.85,-1.15; 2 1.85,-1.15; 3 1.85,1.15; 4 -1.85,1.15

### Placement (x,y rotation side)
C1  17.32,50.65 90 top
C2  20.85,50.72 90 top
C3  11.05,50.77 90 top
C4  7.44,48.03 180 top
C5  22.35,30.4 90 top
C6  11.84,8.66 45 top
C7  5.49,21.54 0 top
C8  34.67,14.55 180 top
C9  29.31,7.54 270 top
C10  27.79,7.54 270 top
C11  40.74,39.73 0 top
C12  39.29,6.86 0 top
C13  36.35,7.7 270 top
C14  24.79,14.63 180 top
C15  24.82,7.32 180 top
C16  38.91,35.15 0 top
C17  40.11,37.44 90 top
C18  30.2,41.73 180 top
C19  38.3,32.03 180 top
C20  39.8,30.28 0 top
C21  8.99,50.72 90 top
C22  11.18,21.79 270 top
C23  5.66,13.92 180 top
C24  10.29,34.95 90 top
C25  34.67,13.11 0 top
C26  10.49,16.03 0 top
C27  14.25,40.87 180 top
C28  20.09,14 180 top
C29  25.83,44.02 270 top
C30  19.23,39.4 0 top
C31  34.11,45.24 180 top
C32  30.58,45.24 0 top
C33  11.99,10.82 225 top
C34  20.75,20.62 0 top
C35  15.29,12.19 270 top
C36  11.33,31.8 180 top
C37  15.8,32.69 90 top
C38  36.7,52.17 90 top
C39  50.88,49.48 270 top
J1  55.5,59.69 180 top
JP1  59.54,46.81 270 top
JP5  5.41,31.06 90 top
L1  16.48,47.07 0 top
L2  31.17,7.34 180 top
L3  42.52,32.46 270 top
L4  42.55,36.65 270 top
L5  31.95,8.66 180 top
L6  34.52,8.66 0 top
L7  9.45,7.77 135 top
L8  14.12,9.68 315 top
L9  58.88,50.67 90 top
LED1  4.88,53.98 180 top
LED2  52.25,27.71 270 top
LED4  52.27,29.69 270 top
R1  5.21,9.47 225 top
R2  21.21,54.66 0 top
R3  18.06,54.66 0 top
R4  15.27,55.55 270 top
R5  20.09,15.47 180 top
R6  11.05,53.95 270 top
R7  8.89,54.03 270 top
R8  48.92,27.71 0 top
R9  6.86,54 90 top
R10  19.02,50.7 270 top
R11  22.1,10.97 270 top
R12  34.52,10.11 0 top
R13  39.17,18.08 90 top
R14  37.62,18.08 90 top
R15  9.93,12.19 225 top
R16  37.95,37.39 90 top
R17  48.92,29.69 0 top
R18  18.85,24.08 270 top
R19  54.53,52.55 270 top
R20  55.8,52.55 270 top
R51  20.09,17.02 180 top
S1  3.1,42.82 90 top
S2  29.24,57.3 0 top
U1  29.84,34.26 180 top
U2  14.53,51.66 0 top
U3  12.83,34.98 180 top
U$1  19.91,2.62 90 top
U$2  46.38,3.78 180 top
U$3  15.21,22.73 180 top
U$4  30.3,11.79 270 top
U$6  15.14,16.66 90 top
U$22  44.02,51.77 0 top
Y1  32.36,48.03 180 top
Y2  21.77,42.32 0 top
Y3  5.36,17.63 270 top
Y4  24.79,10.95 270 top

### Tracks (layer width: path | path; a pad name or v marks a point on that pad's centre or on a via)
3.3V  (via drill 0.6)  (1 unrouted)
  Top 0.178: U3.8 13.44,36.47 13.44,35.92 13.03,35.51 U3.22 | 16.1,33.98 16.97,33.11 v16.97,29.62 | U$22.43 36.9,51.52 C38.1 | 13.03,33.03 13.03,32.65 C36.1 v13.59,30.38 | U3.1 15.36,33.98 C37.2
  Top 0.254: 31.58,39.98 U1.21 31.59,40.82 31.05,41.37 C18.1 | U1.3 35.55,31.52 | 35.55,31.52 36.22,31.52 | L3.2 39.67,31.51 | 39.67,31.51 C19.1 | U1.7 U1.8 36.5,34.02 v37.08,33.43 | 35.55,31.52 34.44,31.52 | 34.44,31.52 29.77,31.52 29.62,31.37 | C24.2 10.46,35.98 U3.13 | U2.2 14.03,49.36 | U$6.VDDA/1 13.39,16.23 13.2,16.41 U$6.VDDD/29 U$6.VDDA/30 11.46,15.91 C26.2 | U$6.VDDA/1 13.39,14.71 13.69,15.01 14.73,15.01 14.89,14.86 | 14.89,14.86 U$6.VDD3P3/4 | U$6.VDD3P3/3 U$6.VDD3P3/4 | 14.89,14.86 14.92,14.88 16.48,14.88 16.84,15.24 16.84,15.67 | 16.84,15.67 17.08,15.91 U$6.VDDPST/11 17.89,15.91 18.06,15.75 18.06,14.48 18.54,13.99 C28.2 | 16.84,15.67 16.84,18.67 16.89,18.72 U$6.VDDPST/17 16.89,19.28 17.07,19.46 19.71,19.46 19.84,19.58 19.84,20.83 | U$4.15 31.3,11.24 | 31.3,11.24 30.26,12.29 U$4.7 | U$6.VDD3P3/4 14.89,13.44 C35.1 | U$6.VDDA/1 13.39,12.22 C33.1 12.48,11.42 11.96,11.94 11.46,11.94 9.68,10.16 8.66,10.16 v8.15,10.67 8.41,10.67 R15.2 | U1.30 27.09,33.89 29.62,31.37 | U$3.8 C22.2 | 31.3,11.24 31.84,11.79 U$4.18 33.4,11.79 | 33.4,11.79 33.81,12.19 33.81,13.09 C25.1 | v38.05,11.25 37.52,11.79 33.4,11.79 | v24.21,28.88 23.53,29.55 C5.1 22.7,29.88 23.32,30.5 U1.48 26.22,30.52 26.7,30.99 27.46,30.99 27.96,30.48 28.73,30.48 29.62,31.37 | 39.67,31.51 38.95,30.79 C20.1 38.93,30.25 v37.08,30.25 36.8,29.97 34.85,29.97 34.47,30.35 34.47,31.5 34.44,31.52 | U$22.43 U$22.42 | 25.45,47.27 25.78,47.6 25.78,51.64 28.5,54.36 31.5,54.36 32.26,53.59 33.4,53.59 34.42,52.58 35.45,52.58 C38.1 | 13.03,33.03 U3.22 | 16.1,33.98 C37.2
  Top 0.406: C22.2 | 14.03,49.36 13.36,48.69 12.28,48.69 11.81,48.22 v11.81,47.5 | C34.1 19.9,22.04 v20.6,22.73 | 31.01,41.66 31.01,42.55 30.28,43.28 29.49,43.28 25.5,47.27 25.45,47.27 23.5,47.27 v22.61,48.16 | 37.64,17.26 35.62,17.26 v34.77,18.11
  Top 0.61: R7.2 8.57,53.18 | 8.15,49.84 8.95,49.84 C21.1 11,49.87 C3.1 | C22.2 10.08,20.93 9.8,21.21 v9.55,21.21 | R14.1 37.64,17.26 39.14,17.26 R13.1
  Top 0.813: 8.15,49.84 6.86,51.13 R9.1 6.88,53.18 R7.2 | C3.1 11.05,48.67 11.81,47.9 v11.81,47.5 11.81,46.33 10.29,44.81 C24.2 10.15,35.94 9.75,35.94 8.28,34.47 v8.28,32.77
  Bottom 0.254: v8.15,10.67 7.64,10.67 7.39,10.92 7.39,11.94 9.8,14.35 | v37.08,33.43 37.36,33.15 37.36,30.53 v37.08,30.25
  Bottom 0.406: v20.6,22.73 21.23,22.73 21.49,22.48 21.49,19.68 20.22,18.41
  Bottom 0.61: v34.75,18.14 v34.77,18.11 | 11.46,19.05 11.46,16 9.8,14.35 | 20.22,18.41 12.09,18.41 11.46,19.05 | 11.46,19.05 9.55,20.95 v9.55,21.21 9.53,21.23 9.53,29.06 | v24.21,28.88 23.47,29.62 v16.97,29.62 16,29.62 15.24,30.38 v13.59,30.38 10.85,30.38 9.53,29.06 | v8.28,32.77 9.53,31.52 9.53,29.06
  Bottom 0.813: JP1.13 JP1.14 | JP1.14 59.28,13.54 | JP1.14 JP1.15 58.88,10.59 38.71,10.59 v38.05,11.25 38.12,11.33 38.12,16.76 37.36,17.53 35.33,17.53 35.33,17.55 v34.75,18.14 33.53,19.36 33.53,24.66 31.27,26.92 26.06,26.92 24.16,28.83 v24.21,28.88 | 59.54,11.63 JP1.14 | v11.81,47.5 10.79,46.48 7.98,46.48 7.09,47.37 7.09,55.12 9.65,57.68 21.46,57.68 22.61,56.54 v22.61,48.16
AD0  (via drill 0.6)
  Top 0.178: v14.71,36.78 14.45,37.03 13.26,37.03 13.03,36.8 U3.9
  Top 0.254: U1.45 25.18,32.02 25.68,32.51 v25.68,33.27
  Bottom 0.254: v14.71,36.78 15.32,36.17 22.78,36.17 v25.68,33.27
FB
  Top 0.254: U2.10 13.53,53.63 13.39,53.77 12.85,53.77
  Top 0.406: 12.85,53.77 12.52,53.44
  Top 0.61: R7.1 R6.2 12.18,53.1 12.52,53.44
GND  (via drill 0.6, 0.61)  (1 unrouted)
  Top 0.178: 11.34,33.96 U3.18 11.3,33.95 11.3,33.33 11.38,33.25 11.38,32.94 11.51,32.82 12.12,32.82 12.23,32.93 U3.20 12.23,33.03 12.04,32.84 | 13.03,51.46 U2.12 | C5.2 22.87,31.25 23.14,30.99
  Top 0.254: U1.47 23.19,31.01 22.62,31.58 C5.2 | U1.4 35.56,32.03 C19.2 37.43,32 32.87,32.03 | C24.1 10.41,33.98 U3.18 | U2.9 14.05,53.16 14.05,53.77 13.34,54.48 | 11.35,22.82 C22.1 11.1,22.72 | U$4.8 26.9,11.79 | U$4.14 30.8,10.52 30.53,10.79 29.34,10.79 29.01,10.46 28.98,10.46 | U$6.GND 15.14,17.09 14.91,17.32 | 6.34,22.47 C7.2 | R4.1 15.3,56.36 | C34.2 21.69,20.62 | U$22.47 40.52,49.52 v41.05,49.78 | v44.09,49.53 45.36,49.53 | L9.1 58.88,49
  Top 0.305: U2.9 14.02,52.22 14.53,52.22 U2.15 15.03,51.16 U2.4 | C3.2 12.82,51.62 U2.12
  Top 0.406: U2.13 15.35,51.23 14.76,51.23 14.53,51.46 U2.15 | R4.1 15.23,56.44 | 11.01,54.83 R6.1
  Top 0.61: C1.2 16.03,51.5 | 16.03,51.5 U2.13 | 16.03,51.5 U2.14
  Top 1.016: 14.53,51.46 13.03,51.46 U2.11
  Bottom 0.254: 15.34,16.46 U$6.GND | v41.05,49.78 41.3,50.29 42.57,50.29 43.33,49.53 v44.09,49.53
  Bottom 0.61: v30.79,32.56 30.43,32.51 30.63,32.46
  other vias: 44.98,36.2 38.96,9.04 15.14,16.66 10.97,24.18 5.64,23.67 20.45,24.66 18.21,56.36 12.34,56.18 14.76,29.08 13.49,29.08 12.22,29.08 10.95,28.83 8.15,25.91 6.88,25.91 5.61,25.91 4.34,25.91 2.82,25.91 2.82,24.64 2.82,23.37 2.82,22.1 2.82,20.83 2.82,19.56 2.82,18.29 2.82,17.02 2.82,15.75 2.82,14.48 2.82,13.21 2.82,11.94 2.82,10.67 2.82,9.4 2.82,8.13 2.82,6.86 4.09,6.86 5.36,6.86 6.63,6.86 7.9,6.86 8.92,5.84 9.93,4.83 12.73,5.33 14,5.33 15.27,5.33 16.54,5.33 17.81,5.33 19.08,5.33 20.35,5.08 20.35,6.35 20.35,7.62 20.35,8.89 20.35,10.16 20.35,11.43 22.25,13.21 22.38,14.61 25.43,16.26 25.43,19.3 25.43,20.57 25.43,21.84 25.43,23.11 21.62,5.33 22.89,5.33 24.16,5.33 25.43,5.33 26.7,5.33 27.97,5.33 29.24,5.33 30.51,5.33 31.78,5.33 32.79,6.1 34.06,6.1 35.2,5.08 37.62,5.33 38.89,5.33 40.16,5.33 41.43,5.33 42.7,5.33 42.7,6.6 42.7,7.87 42.7,9.14 40.16,9.14 41.43,9.14 37.62,8.89 37.11,10.16 36.86,12.95 36.86,14.22 36.86,15.49 35.84,16.26 34.57,16.21 33.22,16.13 32.28,17.27 32.28,18.54 32.28,19.81 32.28,21.08 32.28,22.35 28.22,31.5 29.49,29.97 20.85,12.57 22.5,15.88 23.9,16 25.81,17.78 10.87,3.78 12.09,2.79 12.8,1.7 14.38,1.78 15.65,1.78 16.92,1.78 17.04,3.56 15.77,3.56 14.5,3.56 13.36,4.06 44.48,1.65 44.48,3.43 43.21,1.65 43.21,3.43 41.94,3.43 41.94,1.65 40.67,1.65 40.67,3.43 39.4,3.43 39.4,1.65 38.25,4.19 36.09,3.81 37.11,2.79 38.13,1.78 8.2,27.23 57.3,48.01 57.94,54.03 42.57,15.57 48.87,15.52 54.74,15.62 52.68,8.05 46.2,7.98 17.58,7.87 5.97,2.95 2.57,28.73 2.41,35.94 2.97,49.58 3.02,54.15 2.9,58.27 16,43.23 37.49,46.56 48.49,39.4 55.02,41.78
  pour Top: -1.27,128.65 128.65,128.65 128.65,-0.76 -12.45,-8.89
  pour Bottom: -3.68,128.02 127.64,128.02 127.64,-0.64 -10.49,-6.78
ID  (via drill 0.6, 0.61)
  Top 0.254: U1.23 30.59,38.39 31.01,37.97 v31.01,36.45 | J1.4 56.15,54.24 57.35,53.03 58.5,53.03 v59.54,54.08 | v41.3,53.34 40.62,54.02 U$22.38 36.92,54.02 36.58,54.36 v35.08,54.36
  Bottom 0.254: v31.01,36.45 30.63,36.07 28.85,36.07 28.6,36.32 28.6,50.8 28.85,51.05 31.39,51.05 34.7,54.36 v35.08,54.36 | v41.3,53.34 45.11,53.34 46.76,54.99 49.68,54.99 51.33,56.64 58.98,56.64 59.54,56.08 v59.54,54.08
MTDO
  Top 0.254: U$6.MTDO/13 19.14,16.91 R51.2
N$1
  Top 0.61: R9.2 LED1.A
N$2
  Top 0.254: U2.3 14.53,48.28 15.21,47.6 L1.1
N$7
  Top 0.254: R8.2 LED2.A
N$8
  Top 0.254: J1.3 55.5,53.51 R20.1
N$9
  Top 0.254: J1.2 54.85,53.52 R19.1
N$10
  Top 0.254: Y1.P$2 33.26,47.08 C31.2 32.59,44.57 U1.19
N$11
  Top 0.254: Y1.P$1 31.43,47.11 C32.2 32.09,44.57 U1.20
N$13
  Top 0.254: C6.2 13.45,10.28 L8.1 13.89,10.64 U$6.LNA/2
N$16
  Top 0.254: U$1.FEED 13.54,2.62 10.05,6.11 L7.1 10.35,7.17 C6.1
N$17
  Top 0.254: Y4.1 25.19,11.25 28.49,11.28 U$4.9 | Y4.1 23.64,12.94 23.95,12.94 C14.1 | R11.1 22.41,11.57 Y4.1
N$18
  Top 0.254: Y4.3 27.04,10.79 U$4.10 | Y4.3 24.64,10.4 22.63,10.4 R11.2 | Y4.3 25.94,7.18 C15.1
N$19
  Top 0.254: C10.1 C9.1 | C9.1 29.3,8.9 U$4.11 | C9.1 29.31,8.54 29.96,8.54 30.52,7.99 L2.2
N$20
  Top 0.254: L6.1 L5.1 31.79,9.47 30.56,9.47 30.3,9.73 U$4.13
N$21
  Top 0.254: U$4.19 32.48,12.29 32.74,12.55 32.74,13.6 33.69,14.55 C8.2
N$23
  Top 0.254: L2.1 31.82,8.15 L5.2 30.61,8.66 29.8,9.47 U$4.12
N$24
  Top 0.254: U$4.16 32.1,10.65 32.72,10.03 33.59,10.03 R12.1
N$25
  Top 0.254: L6.2 36.23,8.66 C13.1
N$26
  Top 0.254: C12.1 38.2,6.85 C13.2 36.35,4.83 38.64,2.54 U$2.FEED
N$27
  Top 0.254: U1.32 26.09,42.91 C29.2 23.92,43.17 Y2.3
N$28
  Top 0.254: U1.33 21.46,38.02 C30.2 20.08,41.01 Y2.1
N$29
  Top 0.254: LED4.A R17.2
N$30
  Top 0.254: 13.31,51.56 13.31,51.59 13.36,51.59
N$32
  Top 0.254: U$6.MTCK/12 18.3,16.41 R5.2
N$34  (via drill 0.6)
  Top 0.178: U3.10 12.63,37.24 13.13,37.74 v13.13,37.97
  Top 0.254: C27.2 12.8,40.87 v11.84,39.9
  Bottom 0.178: v11.84,39.9 11.84,39.27 v13.13,37.97
N$35  (via drill 0.6)
  Top 0.178: U$3.6 13.03,23.32 14.28,24.56 v14.28,25.09
  Top 0.254: v16.31,25.68 18.1,25.68 R18.1
  Bottom 0.178: v14.28,25.09 14.28,25.17 14.73,25.63
  Bottom 0.254: v16.31,25.68 14.86,25.68 v14.28,25.09
N$36
  Top 0.178: 13.31,52.32 13.31,52.4
N$37
  Top 0.178: 13.31,50.95 13.31,50.93
N$38
  Top 0.254: U$6.RES12K/31 12.39,15.41 12.01,15.04 11.02,15.04 6.06,10.07 R1.1
N$41
  Top 0.254: 58.98,51.61 59.08,51.61 60.53,53.06 60.53,57.2 59.69,58.04 59.26,58.04 59.05,57.84 59.05,56.31 58.45,55.7
N$42  (1 unrouted)
  Top 0.254: 56.49,58.01 56.31,58.19 56.24,58.19 56.11,58.06 | 54.81,58.06 54.71,57.96 | 54.71,57.96 54.69,57.94 54.63,57.94 54,58.57 52.07,58.57 51.66,58.17 51.66,58.06 51.59,57.99 51.56,57.99 51.46,57.89 51.46,57.15 52.35,56.26 | 54.71,57.96 54.71,58.34 54.94,58.57 56.08,58.57 56.34,58.32 56.08,58.06
N$45
  Top 0.254: 56.57,58.14 56.57,58.45 56.74,58.62 59.54,58.62 59.56,58.6 59.56,58.04 59.79,57.81
N$49
  Top 0.254: U$22.18 50.59,51.52 50.85,51.26 50.85,50.35 C39.1
N$75  (via drill 0.6, 0.61)
  Top 0.254: U$22.20 46.82,52.52 v44.6,54.74 | v38.61,56.34 37.64,57.3 S2.2
  Bottom 0.254: v44.6,54.74 40.21,54.74 v38.61,56.34
PS
  Top 0.254: U2.8 14.53,53.98 13.92,54.59
  Top 0.406: 13.92,54.59 13.92,57.38 14.17,57.63 16.46,57.63
  Top 0.813: 16.46,57.63 19.96,57.63 22.02,55.58 22.02,54.7 R2.2
PTA0  (via drill 0.6)
  Top 0.254: U$22.32 43.27,53.15 44.35,52.07 45.11,52.07 45.36,51.82 45.36,51.13 v45.09,50.85 | v31.9,37.59 31.9,38.35 31.09,39.16 U1.22
  Bottom 0.254: v45.09,50.85 41.25,50.85 39.01,53.09 34.44,53.09 31.9,50.55 29.36,50.55 29.11,50.29 29.11,38.35 30.12,37.34 31.65,37.34 v31.9,37.59
PTA2  (via drill 0.6, 0.61)
  Top 0.254: U1.24 30.12,39.94 30.12,36.07 31.14,35.05 31.14,34.54 30.89,34.29 v30.63,34.29 | U$22.37 37.61,54.52 v36.8,55.32
  Bottom 0.254: v30.63,34.29 30.12,34.29 29.95,34.47 29.95,35.08 29.46,35.56 28.6,35.56 28.09,36.07 28.09,51.05 28.6,51.56 31.14,51.56 32.66,53.09 32.66,54.1 33.88,55.32 v36.8,55.32
PTA3  (via drill 0.6, 0.61)
  Top 0.254: 29.59,39.09 U1.25 29.59,38.18 29.23,37.82 29.23,34.92 v28.85,34.54 29.11,34.8 | U$22.34 U$22.33 42.77,49.73 v42.32,49.28 | v34.44,51.69 33.05,51.69 31.65,53.09 v31.14,53.09
  Bottom 0.254: v34.44,51.69 36.6,51.69 39.65,48.64 41.68,48.64 v42.32,49.28 | v28.85,34.54 28.35,34.54 27.58,35.31 27.58,51.31 28.35,52.07 30.12,52.07 v31.14,53.09
PTB0
  Top 0.178: 11.83,36.84 U3.12 11.83,38.73 12.45,39.34 13.89,39.34 16.22,37.02 U1.35
PTB1
  Top 0.178: U1.36 16.09,36.52 13.72,38.89 12.75,38.89 12.23,38.36 U3.11
PTB16  (via drill 0.6)
  Top 0.254: U1.39 19.8,35.02 18.06,33.27 18.06,28.45 17.8,28.19 11.71,28.19 v8.15,24.64 | U$6.U0TXD/26 9.8,17.91 v9.42,18.29
  Bottom 0.254: v9.42,18.29 8.15,19.56 v8.15,24.64
PTB17  (via drill 0.6)
  Top 0.254: U1.40 19.93,34.52 18.57,33.15 18.57,27.81 18.06,27.3 v17.55,27.3 | v13.99,27.3 12.32,27.3 8.66,23.65 8.66,20.32 10.57,18.41 U$6.U0RXD/25
  Bottom 0.254: v13.99,27.3 v17.55,27.3
PTB18
  Top 0.254: U1.41 20.2,34.02 19.07,32.89 19.07,27.69 22.78,23.98 22.78,19.48 22.28,18.97 18.72,18.97 17.66,17.91 U$6.GPIO0/15
PTB19
  Top 0.254: U1.42 20.46,33.52 19.58,32.64 19.58,28.07 23.29,24.36 23.29,19.23 22.53,18.47 18.97,18.47 17.92,17.41 U$6.GPIO2/14
PTC0  (via drill 0.6)
  Top 0.254: U$6.EXT_RSTB/32 12.6,14.91 11.89,14.2 v11.89,13.84 11.18,13.13 10.87,13.13 R15.1 | U1.43 20.72,33.02 20.09,32.38 20.09,29.34 v23.39,26.04
  Bottom 0.254: v23.39,26.04 23.77,25.65 23.77,18.92 22.81,17.96 20.75,17.96 15.67,12.88 12.85,12.88 v11.89,13.84
PTC1  (via drill 0.6)
  Top 0.254: v23.8,27.41 22.63,28.57 21.61,28.57 20.6,29.59 20.6,32.13 20.98,32.52 U1.44 | U$6.CHIP_EN/7 16.39,12.36 v16.71,12.04
  Bottom 0.254: v23.8,27.41 24.28,26.92 24.28,18.67 23.01,17.4 21.23,17.4 17.55,13.72 17.55,12.45 17.14,12.04 v16.71,12.04
PTC3  (via drill 0.6)
  Top 0.254: U$6.XPD_DCDC/8 16.89,13.62 v18.57,12.19 | v24.41,17.53 24.41,25.65 25.43,26.67 25.43,29.72 25.68,29.97 v26.95,29.97 | U1.46 25.44,31.52 26.19,32.26 26.19,32.51 26.44,32.77 v26.95,32.77
  Bottom 0.254: v26.95,32.77 27.2,32.51 27.2,30.23 v26.95,29.97 | v24.41,17.53 23.77,16.89 21.74,16.89 20.85,16 20.85,13.84 19.2,12.19 v18.57,12.19
PTC4  (via drill 0.6)
  Top 0.254: v25.68,25.27 25.68,25.78 26.09,26.2 U1.49 | U$4.2 30.8,19.01 v29.74,20.07
  Bottom 0.254: v25.68,25.27 26.19,24.77 27.84,24.77 29.36,23.24 29.36,20.45 v29.74,20.07
PTC5  (via drill 0.6)
  Top 0.254: v27.58,20.32 26.59,21.31 U1.50 | U$4.3 30.3,17.6 v28.85,19.05
  Bottom 0.254: v28.85,19.05 v27.58,20.32
PTC6  (via drill 0.6)
  Top 0.254: U1.51 27.09,23.6 27.46,23.24 v27.46,22.73 | U$4.4 29.8,16.32 v27.96,18.16
  Bottom 0.254: v27.46,22.73 27.46,21.59 26.57,20.7 26.57,19.56 v27.96,18.16
PTC7
  Top 0.254: 27.61,28.55 U1.52 27.59,24.37 28.6,23.37 28.6,20.07 27.08,18.54 27.08,17.65 29.3,15.43 U$4.5
PTC8  (via drill 0.6)
  Top 0.254: U1.53 28.09,25.4 30.33,23.16 v30.33,21.84 | 27.46,15.24 v27.46,15.88 27.46,13.72 28.39,12.79 U$4.6
  Bottom 0.254: v27.46,15.88 27.46,16.38 30.76,19.68 30.76,21.41 v30.33,21.84
PTC9
  Top 0.254: U1.54 28.59,25.66 31.3,22.95 U$4.1
PTC10  (via drill 0.6)
  Top 0.254: U1.55 29.09,25.92 31.65,23.37 35.94,23.37 v38.61,20.7
  Bottom 0.254: v38.61,20.7 57.71,20.7 JP1.12
PTC11  (via drill 0.6)
  Top 0.254: U1.56 29.59,26.18 31.9,23.88 37.29,23.88 v39.6,21.57
  Bottom 0.254: v39.6,21.57 59.38,21.57 JP1.11
PTD0  (via drill 0.6)
  Top 0.254: U1.57 30.09,26.45 32.16,24.38 38.89,24.38 v40.82,22.45
  Bottom 0.254: v40.82,22.45 58.04,22.45 JP1.10
PTD1  (via drill 0.6)
  Top 0.254: U1.58 30.59,26.71 32.41,24.89 40.36,24.89 v41.73,23.52
  Bottom 0.254: v41.73,23.52 56.57,23.52 JP1.9
PTD2  (via drill 0.6)
  Top 0.254: U1.59 31.09,26.97 32.66,25.4 41.91,25.4 v42.65,24.66
  Bottom 0.254: v42.65,24.66 55.17,24.66 JP1.8
PTD3  (via drill 0.6)
  Top 0.254: U1.60 31.59,27.23 32.92,25.91 43.46,25.91 v43.61,25.76
  Bottom 0.254: 53.14,28.42 53.16,28.45 | 53.16,28.45 56.29,31.57 JP1.7 | 53.16,28.45 47.98,28.45 45.29,25.76 v43.61,25.76
PTD4  (via drill 0.6)
  Top 0.254: U1.61 32.09,27.49 33.17,26.42 41.68,26.42 42.06,26.8 v44.65,26.8
  Bottom 0.254: v44.65,26.8 45.39,26.8 46.38,27.79 46.38,31.7 48.79,34.11 JP1.6
PTD5  (via drill 0.6)
  Top 0.254: U1.62 32.59,27.75 33.43,26.92 41.3,26.92 42.44,28.07 v45.41,28.07
  Bottom 0.254: v45.41,28.07 45.77,28.42 45.77,33.68 48.74,36.65 JP1.5
PTD6
  Top 0.254: U1.63 33.09,27.89 33.55,27.43 41.05,27.43 42.57,28.96 46.13,28.96 47.37,27.71 R8.1
PTD7
  Top 0.254: U1.64 33.59,29.12 33.93,29.46 34.7,29.46 36.22,27.94 40.79,27.94 42.32,29.46 47.84,29.46 R17.1
RESET_B  (via drill 0.6, 0.61)
  Top 0.254: U1.34 25.22,37.52 v25.81,38.1 | 37.74,48.26 37.87,48.26 | 37.87,48.26 44.35,48.26 44.77,47.84 U$22.8 | 37.87,48.26 35.33,50.8 32.03,50.8 29.74,53.09 v29.36,53.09
  Bottom 0.254: v25.81,38.1 27.08,39.37 27.08,51.56 28.6,53.09 v29.36,53.09
SCL  (via drill 0.6)
  Top 0.178: U1.37 15.57,36.02 14.73,35.18 13.56,35.18 13.43,35.04 U3.23
  Top 0.254: U1.37 25.5,36.02 v25.93,36.45 | 37.82,19.14 R14.2 36.54,18.93 v35.48,19.99 v35.48,22.17
  Bottom 0.254: v25.93,36.45 26.19,36.45 26.7,35.94 26.7,35.18 30.38,31.5 31.52,31.5 35.2,27.81 35.2,23.11 35.48,22.84 v35.48,22.17
SD-CLK
  Top 0.178: 17.93,21.51 17.09,21.51 16.43,22.17 15.21,22.17 14.84,21.8 14.84,18.96 U$6.SD_CLK/21
  Top 0.254: 17.93,21.51 18.82,21.51 19.1,21.79 19.1,22.98 R18.2
SD-CMD
  Top 0.178: U$3.1 17.34,21.01 17.02,21.01 16.28,21.74 15.6,21.74 15.24,21.39 15.24,20.04 15.39,19.89 U$6.SD_CMD/20
SD-D0
  Top 0.178: U$3.2 16.92,22.63 14.99,22.63 14.39,22.03 U$6.SD_DATA_0/22
SD-D1  (via drill 0.6)
  Top 0.178: v12.34,19.58 13.59,19.58 13.89,19.28 U$6.SD_DATA_1/23 | U$3.5 13.02,25.64 v12.78,25.88
  Bottom 0.178: v12.78,25.88 12.57,25.88 12.34,25.65 12.34,20.32 12.09,20.07 12.09,19.84 v12.34,19.58
SD-D2  (via drill 0.6)
  Top 0.178: U$3.7 13.4,22.13 14.5,23.23 v14.5,23.42 | v18.49,20.5 18.36,20.37 16.84,20.37 16.39,19.92 U$6.SD_DATA_2/18
  Bottom 0.178: v14.5,23.42 14.5,23.75 15.32,24.56 16.79,24.56 18.49,22.86 v18.49,20.5
SD-D3  (via drill 0.6)
  Top 0.178: v16.05,23.55 16.26,23.75 17,23.75 U$3.3 | U$6.SD_DATA_3/19 15.89,20.64 v16.03,20.78
  Bottom 0.178: v16.03,20.78 16.03,23.52 v16.05,23.55
SDA  (via drill 0.6)
  Top 0.178: U1.38 19.05,35.52 18.65,35.52 16.62,35.52 v16.1,35 | U3.24 13.83,32.3 v14.12,32
  Top 0.254: R13.2 38.84,19.04 | v36.5,21.18 37.82,19.86 38.86,19.86 39.17,19.56 R13.2 | 39.46,18.96 R13.2 | U1.38 25.09,35.52 v26.19,34.42
  Bottom 0.254: v26.19,34.42 26.7,34.42 30.12,30.99 31.27,30.99 34.57,27.69 34.57,21.57 34.95,21.18 v36.5,21.18 | v14.12,32 14.99,32 15.44,32.46 15.44,34.34 v16.1,35
SOFTPOWER
  Top 0.254: U2.6 15.53,53.65 15.7,53.82 16.2,53.82 16.97,53.06
  Top 0.406: 16.97,53.06 17.51,53.06 R10.1
USB_D_N
  Top 0.254: R19.2 54.53,51.69 54.94,51.28 54.94,49.37 49.21,43.64 36.86,43.64 35.1,41.88 35.1,39.47 33.98,38.35 33.98,33.15 34.62,32.52 U1.5
USB_D_P
  Top 0.254: R20.2 55.8,51.69 55.4,51.28 55.4,49.18 49.4,43.18 37.05,43.18 35.56,41.69 35.56,39.27 34.44,38.16 34.44,33.34 34.77,33.02 U1.6
UVLO
  Top 0.254: U2.7 15.03,54.46 R4.2
  Top 0.406: R3.1 17.21,54.24 17.8,53.65 18.78,53.65 C2.2
  Top 1.016: R4.2 15.3,54.66 R3.1
VAUX  (via drill 0.6)
  Top 0.254: U2.1 13.53,49.75 13.23,49.45
  Top 0.406: 13.23,49.45 12.98,49.45 v12.47,49.96
  Top 0.61: v9.86,47.98 9.8,48.03 C4.1
  Bottom 0.61: v12.47,49.96 12.22,49.96 10.24,47.98 v9.86,47.98
VBAT
  Top 0.813: JP5.2 5.41,36.88 8.15,39.62 8.15,43.18 6.26,45.07 S1.3
VCC  (via drill 0.61)
  Top 0.254: U2.5 15.53,49.7 15.77,49.45
  Top 0.406: 15.77,49.45 16.41,49.45 | R10.2 19.05,49.87 C2.1 20.97,49.99 21.92,49.99 22.35,50.42 22.35,52.12 21.67,52.81 21.21,52.81 20.36,53.66 R2.1
  Top 0.61: 16.41,49.45 16.98,49.45 | 16.98,49.45 C1.1 17.37,49.85 R10.2 | 16.98,49.45 17.75,48.68 L1.2 | R3.2 R2.1
  Top 0.813: v20.62,48.28 20.85,48.51 C2.1 | S1.2 4.86,42.09 v6.68,42.09
  Bottom 0.813: v20.62,48.28 19.46,47.12 13.74,47.12 8.71,42.09 v6.68,42.09
VDDA
  Top 0.254: 37.97,36.39 R16.1 | R16.1 37.79,36.52 U1.13 | C17.1 40.16,36.22 | L3.1 40.97,34.96 40.97,35.73 C17.1 | C17.1 38,36.59 R16.1
VREF_OUT  (via drill 0.6)
  Top 0.254: U1.17 33.59,39.36 32.79,38.56 32.79,37.21 32.16,36.58 v32.16,33.3 | C16.1 38.06,34 v38.33,33.73
  Bottom 0.254: v32.16,33.3 32.16,32.26 35.23,29.18 37.95,29.18 38.33,29.57 v38.33,33.73 38.33,32.79
VREFH
  Top 0.254: U1.14 36.9,37.02 R16.2 39.43,39.73 C11.1
VREFL  (via drill 0.6)
  Top 0.254: U1.15 U1.16 36.59,38.02 37.08,38.51 37.08,39.5 38.28,40.69 42.34,40.69 v43.18,39.85 41.87,39.85 41.8,39.93 C11.2 41.17,39.31 41.17,38.3 | L4.2 41.9,35.7 41.17,36.42 41.17,38.3 | C16.2 39.76,33.62 v40.66,32.72 | C17.2 41.16,38.29 41.17,38.3
  Bottom 0.254: v40.66,32.72 41.2,32.72 43.18,34.7 v43.18,39.85
VUSB  (via drill 0.6)
  Top 0.406: J1.1 54.2,54.94 53.62,54.36 51.26,54.36 49.43,56.19 v49.43,56.9
  Top 0.813: S1.1 6.56,40.57 v6.63,40.64
  Bottom 0.813: v6.63,40.64 9.3,40.64 14.5,45.85 23.14,45.85 24.66,47.37 24.66,52.58 29.74,57.66 48.67,57.66 v49.43,56.9
XTAL_IN
  Top 0.254: C23.1 Y3.3 7.64,16.91 U$6.XTAL_IN/28
XTAL_OUT
  Top 0.254: 4.21,21.11 C7.1 4.64,19.91 Y3.1 6.28,17.41 U$6.XTAL_OUT/27